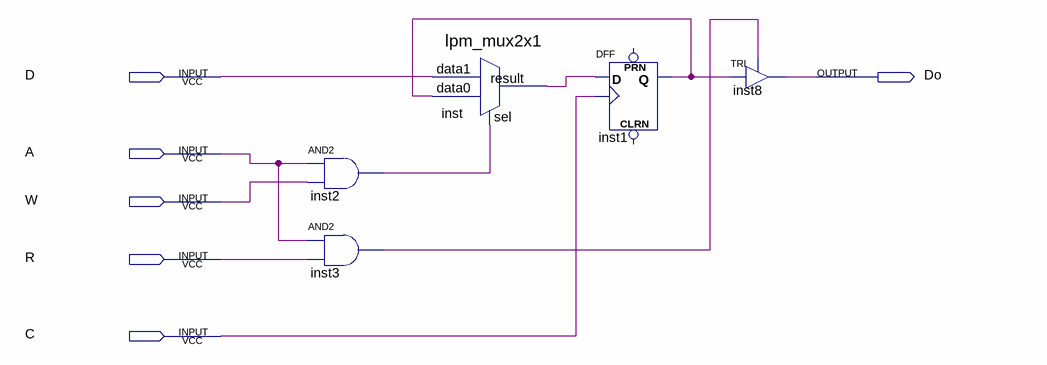
[diagram p0: schematic sheet]
// Quartus schematic RAM1x1D.bdf as structural Verilog: 5 symbols, 6 pins
module RAM1x1D (
  input  D,
  input  A,
  input  W,
  input  R,
  input  C,
  output Do
);

  wire inst1_q, inst2_out, inst3_out, inst_result;

  and inst2 (inst2_out, A, W);
  and inst3 (inst3_out, A, R);
  lpm_mux2x1 inst (.data1(D), .data0(inst1_q), .sel(inst2_out), .result(inst_result));
  DFF inst1 (.CLK(C), .D(inst_result), .Q(inst1_q));  // open: CLRN, PRN
  TRI inst8 (.IN(inst1_q), .OE(inst3_out), .OUT(Do));
endmodule
